# EAGLE schematic Accumulator (EAGLE 9.2.2)
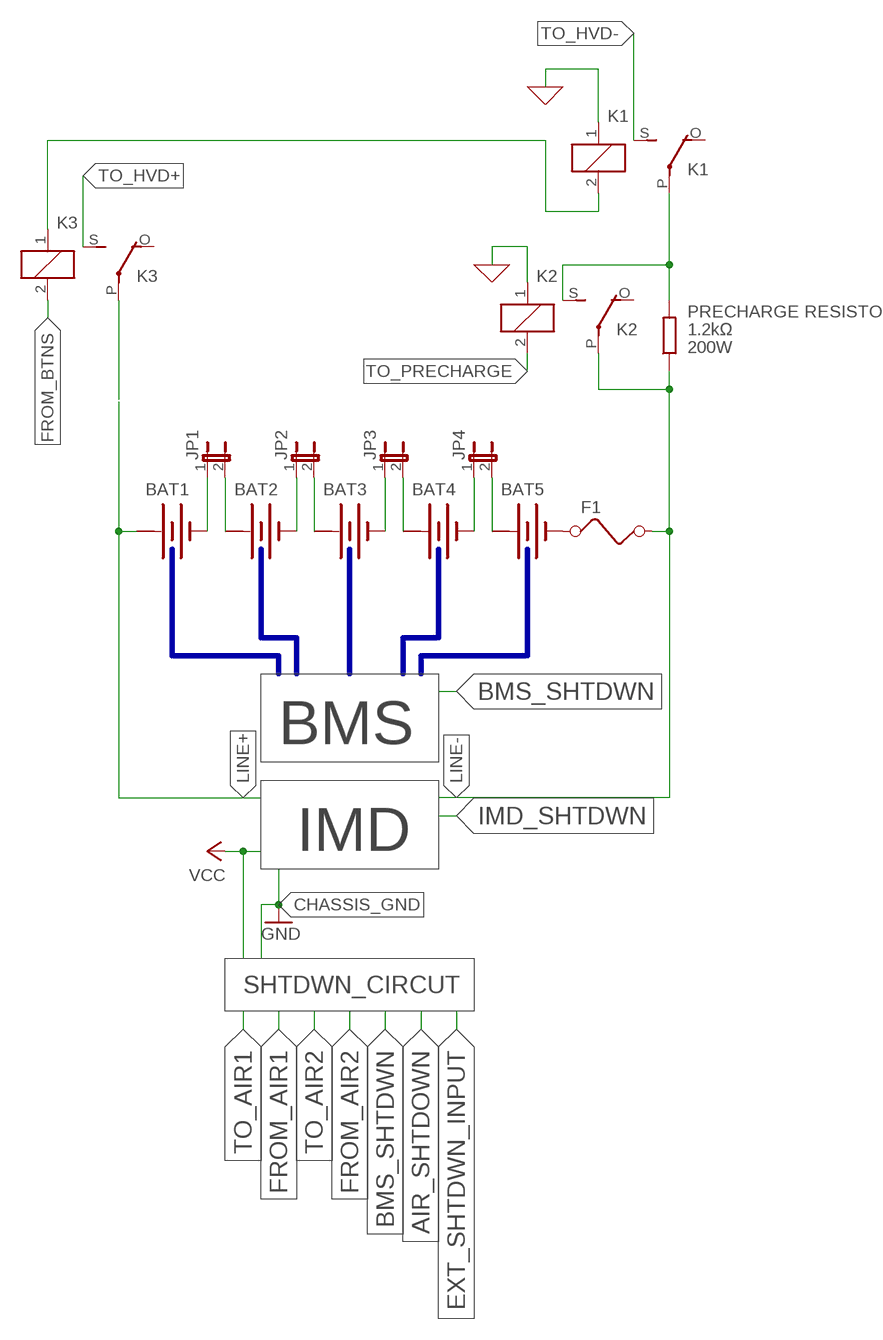
[diagram p0: schematic, sheet 1]

## Parts
BAT1  BATTERY  [BATTERY]
BAT2  BATTERY  [BATTERY]
BAT3  BATTERY  [BATTERY]
BAT4  BATTERY  [BATTERY]
BAT5  BATTERY  [BATTERY]
F1  FUSE  [FUSE]
JP1  JP1E  [JP1]
JP2  JP1E  [JP1]
JP3  JP1E  [JP1]
JP4  JP1E  [JP1]
K1  E3206S  [E3206S]
K2  E3206S  [E3206S]
K3  E3206S  [E3206S]

## Nets
0: K1.1 K2.1 ; supply symbol labelled GND
FROM_BTNS: K3.2
LINE+: BAT1.+
LINE-: F1.2 K2.P(2:P)
N$1: BAT1.- JP1.1
N$2: BAT2.+ JP1.2
N$3: BAT2.- JP2.1
N$4: BAT3.+ JP2.2
N$5: BAT3.- JP3.1
N$6: BAT4.+ JP3.2
N$7: BAT4.- JP4.1
N$8: BAT5.+ JP4.2
N$9: BAT5.- F1.1
N$10: K1.P(2:P) K2.S(2:S)
N$14: K3.P(2:P)
TO_AIR2: K1.2 K3.1
TO_HVD+: K3.S(2:S)
TO_HVD-: K1.S(2:S)
TO_PRECHARGE: K2.2
Unconnected: K1.O(2:O) K2.O(2:O) K3.O(2:O)

## Buses
B$1
B$2
B$3
B$4
B$5

## Notes on the sheet
- PRECHARGE RESISTOR
- 1.2kΩ
- 200W
- BMS
- IMD
- SHTDWN_CIRCUT

## Power pins joined to a net without a drawn wire
+: BAT1.+@1(+) BAT2.+@1(+) BAT3.+@1(+) BAT4.+@1(+) BAT5.+@1(+)

## Library data of the parts
BAT1-BAT5 = special:BATTERY: BATTERY
F1 = special:FUSE: FUSE 5 x 20 mm
JP1-JP4 = jumper:JP1E: JUMPER
K1-K3 = relay:E3206S: RELAY 1 x switch, Eichhoff/distributor Schukat; OC_FARNELL: unknown; OC_NEWARK: unknown